# Altium schematic sheet SensorDSC.SchDoc
size A4
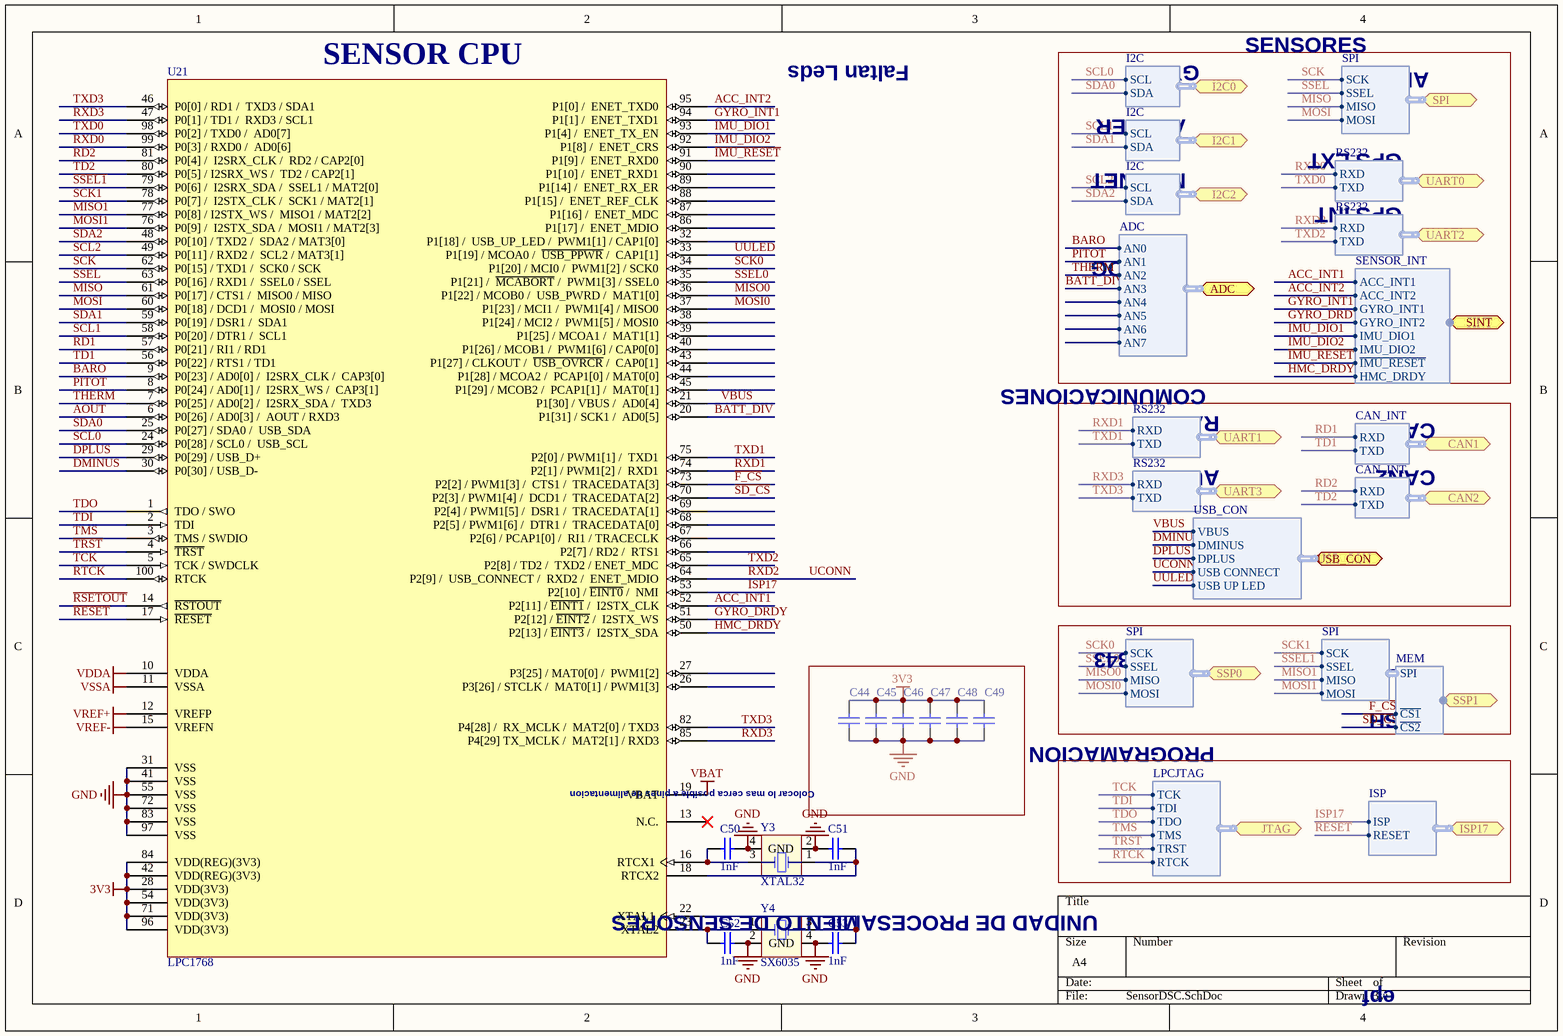
[diagram p0: SensorDSC.SchDoc]

## Parts
C44  Capacitor  [CAP0402]  (value not drawn)
C45  Capacitor  [CAP0402]  (value not drawn)
C46  Capacitor  [CAP0402]  (value not drawn)
C47  Capacitor  [CAP0402]  (value not drawn)
C48  Capacitor  [CAP0402]  (value not drawn)
C49  Capacitor  [CAP0402]  (value not drawn)
C50  value 1nF  [CAP0402]  (hidden comment: Capacitor)
C51  value 1nF  [CAP0402]  (hidden comment: Capacitor)
C52  value 1nF  [CAP0402]  (hidden comment: Capacitor)
C53  value 1nF  [CAP0402]  (hidden comment: Capacitor)
U21  LPC1768  [SOT407-1 LPC1768]
Y3  XTAL32  [XTAL32]
Y4  SX6035  [SX6035]

## Blocks framed on the sheet
Colocar lo mas cerca posible a pines de alimentacion: C44-C49

## Ports
ADC (harness ADC), CAN1 (harness CAN_INT), CAN2 (harness CAN_INT), I2C0 (harness I2C), I2C1 (harness I2C), I2C2 (harness I2C), ISP17 (harness ISP), JTAG (harness LPCJTAG), SINT (harness SENSOR_INT), SPI (harness SPI), SSP0 (harness SPI), SSP1 (harness MEM), UART0 (harness RS232), UART1 (harness RS232), UART2 (harness RS232), UART3 (harness RS232), USB_CON (harness USB_CON)

## Harnesses
CAN_INT: RXD, TXD
LPCJTAG: TCK, TDI, TDO, TMS, TRST, RTCK
I2C: SCL, SDA
RS232: RXD, TXD
ISP: ISP, RESET
SPI: SCK, SSEL, MISO, MOSI
ADC: AN0, AN1, AN2, AN3, AN4, AN5, AN6, AN7
USB_CON: DMINUS, DPLUS, VBUS, USB CONNECT, USB UP LED
MEM: SPI, ~{CS1}, ~{CS2}
SENSOR_INT: ACC_INT1, ACC_INT2, GYRO_INT1, GYRO_INT2, IMU_DIO1, IMU_DIO2, ~{IMU_RESET}, HMC_DRDY

## Nets
3V3: C44.2 C45.2 C46.2 C47.2 C48.2 C49.2 U21.28(VDD(3V3)) U21.42(VDD(REG)(3V3)) U21.54(VDD(3V3)) U21.71(VDD(3V3)) U21.84(VDD(REG)(3V3)) U21.96(VDD(3V3))
GND: C44.1 C45.1 C46.1 C47.1 C48.1 C49.1 C50.1 C51.2 C52.1 C53.2 U21.31(VSS) U21.41(VSS) U21.55(VSS) U21.72(VSS) U21.83(VSS) U21.97(VSS) Y3.2(GND) Y3.4(GND) Y4.2(GND) Y4.4(GND)
VBAT: U21.19(VBAT)
VDDA: U21.10(VDDA)
VREF+: U21.12(VREFP)
VREF-: U21.15(VREFN)
VSSA: U21.11(VSSA)
~{F_CS}: U21.73(P2[2]_/_PWM1[3]_/__CTS1_/__TRACEDATA[3]) ; port SSP1.~{CS1}
~{IMU_RESET}: U21.91(P1[9]_/__ENET_RXD0) ; port SINT.~{IMU_RESET}
~{RESET}: U21.17(~{RESET}) ; port ISP17.RESET
~{RSETOUT}: U21.14(~{RSTOUT})
~{SD_CS}: U21.70(P2[3]_/_PWM1[4]_/__DCD1_/__TRACEDATA[2]) ; port SSP1.~{CS2}
~{SSEL1}: U21.79(P0[6]_/__I2SRX_SDA_/__SSEL1_/_MAT2[0]) ; harness SPI.SSEL
~{TRST}: U21.4(~{TRST}) ; port JTAG.TRST
ACC_INT1: U21.52(P2[11]_/_~{EINT1}_/__I2STX_CLK) ; port SINT.ACC_INT1
ACC_INT2: U21.95(P1[0]_/__ENET_TXD0) ; port SINT.ACC_INT2
AOUT: U21.6(P0[26]_/_AD0[3]_/__AOUT_/_RXD3)
BARO: U21.9(P0[23]_/_AD0[0]_/__I2SRX_CLK_/__CAP3[0]) ; port ADC.AN0
BATT_DIV: U21.20(P1[31]_/_SCK1_/__AD0[5]) ; port ADC.AN3
DMINUS: U21.30(P0[30]_/_USB_D-) ; port USB_CON.DMINUS
DPLUS: U21.29(P0[29]_/_USB_D+) ; port USB_CON.DPLUS
GYRO_DRDY: U21.51(P2[12]_/_~{EINT2}_/__I2STX_WS) ; port SINT.GYRO_INT2
GYRO_INT1: U21.94(P1[1]_/__ENET_TXD1) ; port SINT.GYRO_INT1
HMC_DRDY: U21.50(P2[13]_/_~{EINT3}_/__I2STX_SDA) ; port SINT.HMC_DRDY
IMU_DIO1: U21.93(P1[4]_/__ENET_TX_EN) ; port SINT.IMU_DIO1
IMU_DIO2: U21.92(P1[8]_/__ENET_CRS) ; port SINT.IMU_DIO2
ISP17: U21.53(P2[10]_/_~{EINT0}_/__NMI) ; port ISP17.ISP
MISO: U21.61(P0[17]_/_CTS1_/__MISO0_/_MISO) ; port SPI.MISO
MISO0: U21.36(P1[22]_/_MCOB0_/__USB_PWRD_/__MAT1[0]) ; port SSP0.MISO
MISO1: U21.77(P0[8]_/_I2STX_WS_/__MISO1_/_MAT2[2]) ; harness SPI.MISO
MOSI: U21.60(P0[18]_/_DCD1_/__MOSI0_/_MOSI) ; port SPI.MOSI
MOSI0: U21.37(P1[23]_/_MCI1_/__PWM1[4]_/_MISO0) ; port SSP0.MOSI
MOSI1: U21.76(P0[9]_/__I2STX_SDA_/__MOSI1_/_MAT2[3]) ; harness SPI.MOSI
PITOT: U21.8(P0[24]_/_AD0[1]_/__I2SRX_WS_/__CAP3[1]) ; port ADC.AN1
RD1: U21.57(P0[21]_/_RI1_/_RD1) ; port CAN1.RXD
RD2: U21.81(P0[4]_/__I2SRX_CLK_/__RD2_/_CAP2[0]) ; port CAN2.RXD
RTCK: U21.100(RTCK) ; port JTAG.RTCK
RXD0: U21.99(P0[3]_/_RXD0_/__AD0[6]) ; port UART0.RXD
RXD1: U21.74(P2[1]_/_PWM1[2]_/__RXD1) ; port UART1.RXD
RXD2: U21.64(P2[9]_/__USB_CONNECT_/__RXD2_/__ENET_MDIO) ; port UART2.RXD, port USB_CON.USB CONNECT  [also labelled UCONN]
RXD3: U21.47(P0[1]_/_TD1_/__RXD3_/_SCL1) U21.85(P4[29]_TX_MCLK_/__MAT2[1]_/_RXD3) ; port UART3.RXD
SCK: U21.62(P0[15]_/_TXD1_/__SCK0_/_SCK) ; port SPI.SCK
SCK0: U21.34(P1[20]_/_MCI0_/__PWM1[2]_/_SCK0) ; port SSP0.SCK
SCK1: U21.78(P0[7]_/__I2STX_CLK_/__SCK1_/_MAT2[1]) ; harness SPI.SCK
SCL0: U21.24(P0[28]_/_SCL0_/__USB_SCL) ; port I2C0.SCL
SCL1: U21.58(P0[20]_/_DTR1_/__SCL1) ; port I2C1.SCL
SCL2: U21.49(P0[11]_/_RXD2_/__SCL2_/_MAT3[1]) ; port I2C2.SCL
SDA0: U21.25(P0[27]_/_SDA0_/__USB_SDA) ; port I2C0.SDA
SDA1: U21.59(P0[19]_/_DSR1_/__SDA1) ; port I2C1.SDA
SDA2: U21.48(P0[10]_/_TXD2_/__SDA2_/_MAT3[0]) ; port I2C2.SDA
SSEL: U21.63(P0[16]_/_RXD1_/__SSEL0_/_SSEL) ; port SPI.SSEL
SSEL0: U21.35(P1[21]_/__~{MCABORT}_/__PWM1[3]_/_SSEL0) ; port SSP0.SSEL
TCK: U21.5(TCK_/_SWDCLK) ; port JTAG.TCK
TD1: U21.56(P0[22]_/_RTS1_/_TD1) ; port CAN1.TXD
TD2: U21.80(P0[5]_/_I2SRX_WS_/__TD2_/_CAP2[1]) ; port CAN2.TXD
TDI: U21.2(TDI) ; port JTAG.TDI
TDO: U21.1(TDO_/_SWO) ; port JTAG.TDO
THERM: U21.7(P0[25]_/_AD0[2]_/__I2SRX_SDA_/__TXD3) ; port ADC.AN2
TMS: U21.3(TMS_/_SWDIO) ; port JTAG.TMS
TXD0: U21.98(P0[2]_/_TXD0_/__AD0[7]) ; port UART0.TXD
TXD1: U21.75(P2[0]_/_PWM1[1]_/__TXD1) ; port UART1.TXD
TXD2: U21.65(P2[8]_/_TD2_/__TXD2_/_ENET_MDC) ; port UART2.TXD
TXD3: U21.46(P0[0]_/_RD1_/__TXD3_/_SDA1) U21.82(P4[28]_/__RX_MCLK_/__MAT2[0]_/_TXD3) ; port UART3.TXD
UULED: U21.33(P1[19]_/_MCOA0_/__~{USB_PPWR}_/__CAP1[1]) ; port USB_CON.USB UP LED
VBUS: U21.21(P1[30]_/_VBUS_/__AD0[4]) ; port USB_CON.VBUS
NetC50_2: C50.2 U21.16(RTCX1) Y3.3(XTAL)
NetC51_1: C51.1 U21.18(RTCX2) Y3.1(XTAL)
NetC52_2: C52.2 U21.23(XTAL2) Y4.1(XTAL)
NetC53_1: C53.1 U21.22(XTAL1) Y4.3(XTAL)

Not connected (* = marked no-connect by the designer): U21 13(N.C.)* 26(P3[26]_/_STCLK_/__MAT0[1]_/_PWM1[3]) 27(P3[25]_/_MAT0[0]_/__PWM1[2]) 32(P1[18]_/__USB_UP_LED_/__PWM1[1]_/_CAP1[0]) 38(P1[24]_/_MCI2_/__PWM1[5]_/_MOSI0) 39(P1[25]_/_MCOA1_/__MAT1[1]) 40(P1[26]_/_MCOB1_/__PWM1[6]_/_CAP0[0]) 43(P1[27]_/_CLKOUT_/__~{USB_OVRCR}_/__CAP0[1]) 44(P1[28]_/_MCOA2_/__PCAP1[0]_/_MAT0[0]) 45(P1[29]_/_MCOB2_/__PCAP1[1]_/__MAT0[1]) 66(P2[7]_/_RD2_/__RTS1) 67(P2[6]_/_PCAP1[0]_/__RI1_/_TRACECLK) 68(P2[5]_/_PWM1[6]_/__DTR1_/__TRACEDATA[0]) 69(P2[4]_/_PWM1[5]_/__DSR1_/__TRACEDATA[1]) 86(P1[17]_/__ENET_MDIO) 87(P1[16]_/__ENET_MDC) 88(P1[15]_/__ENET_REF_CLK) 89(P1[14]_/__ENET_RX_ER) 90(P1[10]_/__ENET_RXD1)

## Notes on the sheet
- (near U21) SENSOR CPU
- Faltan Leds
- ACELER
- GYRO
- SENSORES
- ADIS
- MAGNET
- GPS EXT
- ANALOG
- GPS INT
- COMUNICACIONES
- RADIO
- CAN1
- AUX
- CAN2
- LPC1343
- SD_CARD
- FLASH
- PROGRAMACION
- UNIDAD DE PROCESAMIENTO DE SENSORES
- epf

## Library data of the parts
C44-C49 = Cap: Value: 100nF
C50-C53 = Cap
U21 = LPC1768FBD100: ARM CortexM3 512K Flash, 64k RAM, CAN, USB, Ethernet, DAC; Code_IEC: 136E05; Published: 31-Jul-2006; DatasheetVersion: rev.01, Jan-2006; PackageVersion: Feb-2003; PackageReference: SOT313-2; Publisher: Altium Limited; PackageDescription: 48-Pin Plastic Low Profile Quad Flat Pack; Code_JEDEC: MS-026; ComponentLink1Description: Manufacturer Link; ComponentLink1URL: http://www.nxp.com/; ComponentLink2Description: Datasheet; ComponentLink2URL: http://www.standardics.nxp.com/products/lpc2000/datasheet/lpc2101.lpc2102.lpc2103.pdf
Y3 = XTAL32: Crystal Oscillator; Published: 8-Jun-2000; LatestRevisionDate: 17-Jul-2002; LatestRevisionNote: Re-released for DXP Platform.; PackageReference: R38; Publisher: Altium Limited
Y4 = XTAL_SX6035